# Altium schematic sheet 13.RK3588_PCIE2.0_PCIE3.0.SchDoc
size A3; SheetNumber: 13; SheetTotal: 21
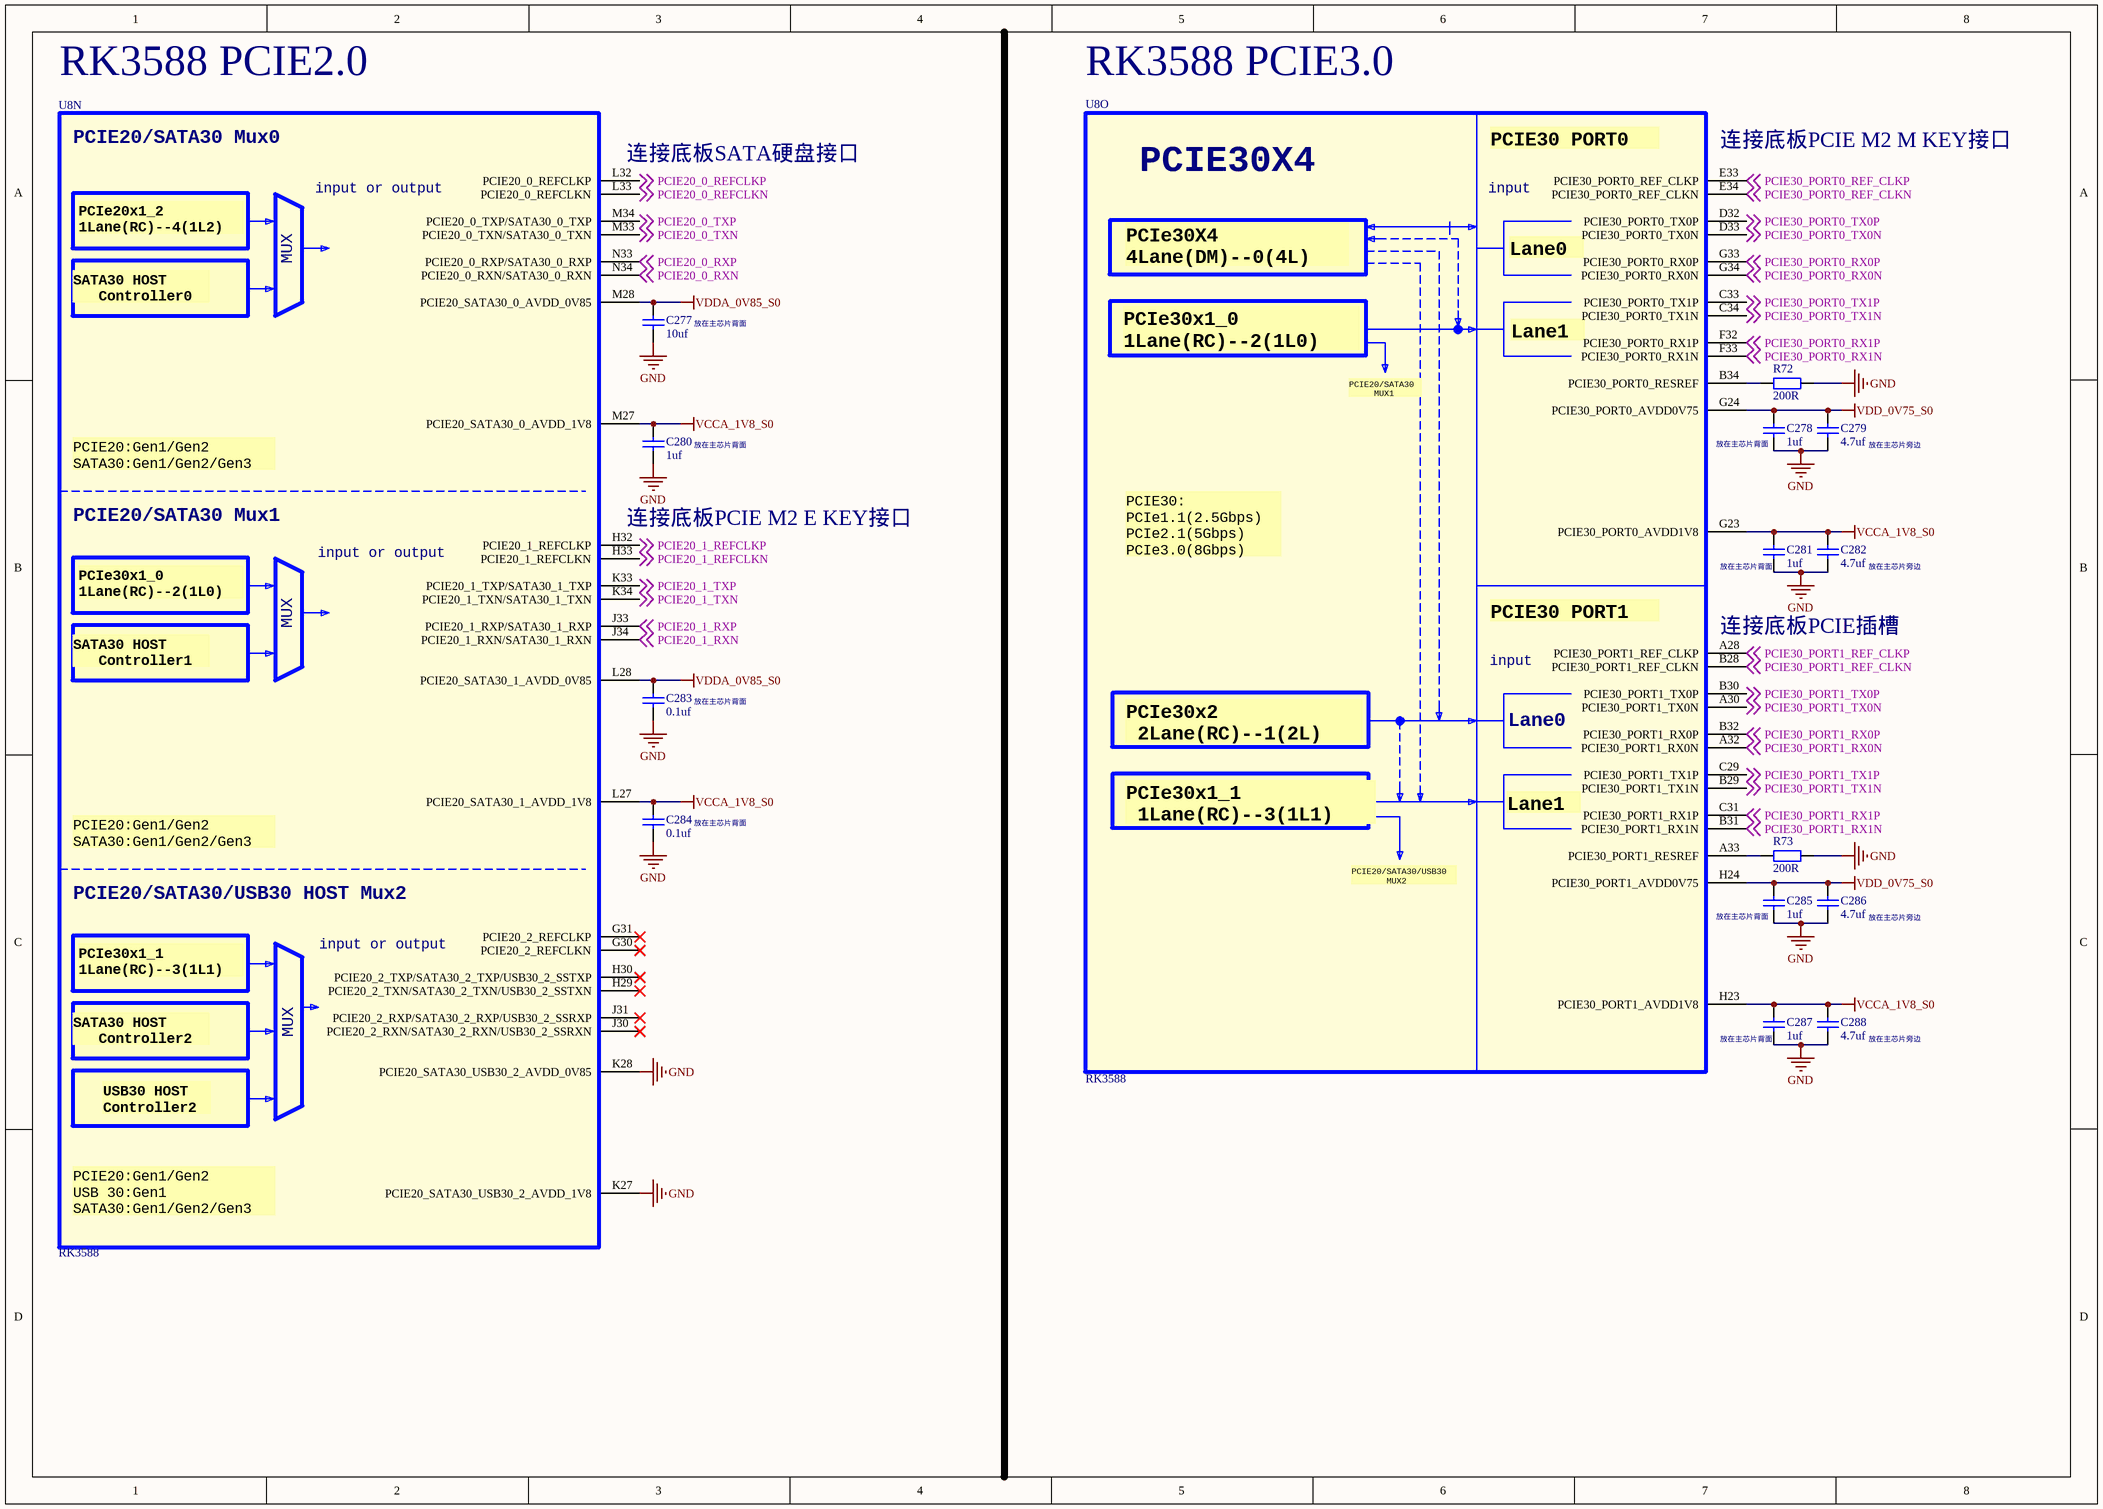
[diagram p0: 13.RK3588_PCIE2.0_PCIE3.0.SchDoc]

## Parts
C277  10uf  [C0201_L]
C278  1uf  [C0201_L]
C279  4.7uf  [C0402_L]
C280  1uf  [C0201_L]
C281  1uf  [C0201_L]
C282  4.7uf  [C0402_L]
C283  0.1uf  [C0201_L]
C284  0.1uf  [C0201_L]
C285  1uf  [C0201_L]
C286  4.7uf  [C0402_L]
C287  1uf  [C0201_L]
C288  4.7uf  [C0402_L]
R72  200R  [R0201_L]
R73  200R  [R0201_L]
U8  RK3588  [BGA1088_23R00X23R00X2R00]  (parts N,O of 26)

## Nets
GND: C277.1 C278.1 C279.1 C280.1 C281.1 C282.1 C283.1 C284.1 C285.1 C286.1 C287.1 C288.1 R72.2 R73.2 U8.K27(PCIE20_SATA30_USB30_2_AVDD_1V8) U8.K28(PCIE20_SATA30_USB30_2_AVDD_0V85)
VCCA_1V8_S0: C280.2 C281.2 C282.2 C284.2 C287.2 C288.2 U8.G23(PCIE30_PORT0_AVDD1V8) U8.H23(PCIE30_PORT1_AVDD1V8) U8.L27(PCIE20_SATA30_1_AVDD_1V8) U8.M27(PCIE20_SATA30_0_AVDD_1V8)
VDD_0V75_S0: C278.2 C279.2 C285.2 C286.2 U8.G24(PCIE30_PORT0_AVDD0V75) U8.H24(PCIE30_PORT1_AVDD0V75)
VDDA_0V85_S0: C277.2 C283.2 U8.L28(PCIE20_SATA30_1_AVDD_0V85) U8.M28(PCIE20_SATA30_0_AVDD_0V85)
PCIE20_0_REFCLKN: U8.L33(PCIE20_0_REFCLKN) ; off-sheet PCIE20_0_REFCLKN
PCIE20_0_REFCLKP: U8.L32(PCIE20_0_REFCLKP) ; off-sheet PCIE20_0_REFCLKP
PCIE20_0_RXN: U8.N34(PCIE20_0_RXN/SATA30_0_RXN) ; off-sheet PCIE20_0_RXN
PCIE20_0_RXP: U8.N33(PCIE20_0_RXP/SATA30_0_RXP) ; off-sheet PCIE20_0_RXP
PCIE20_0_TXN: U8.M33(PCIE20_0_TXN/SATA30_0_TXN) ; off-sheet PCIE20_0_TXN
PCIE20_0_TXP: U8.M34(PCIE20_0_TXP/SATA30_0_TXP) ; off-sheet PCIE20_0_TXP
PCIE20_1_REFCLKN: U8.H33(PCIE20_1_REFCLKN) ; off-sheet PCIE20_1_REFCLKN
PCIE20_1_REFCLKP: U8.H32(PCIE20_1_REFCLKP) ; off-sheet PCIE20_1_REFCLKP
PCIE20_1_RXN: U8.J34(PCIE20_1_RXN/SATA30_1_RXN) ; off-sheet PCIE20_1_RXN
PCIE20_1_RXP: U8.J33(PCIE20_1_RXP/SATA30_1_RXP) ; off-sheet PCIE20_1_RXP
PCIE20_1_TXN: U8.K34(PCIE20_1_TXN/SATA30_1_TXN) ; off-sheet PCIE20_1_TXN
PCIE20_1_TXP: U8.K33(PCIE20_1_TXP/SATA30_1_TXP) ; off-sheet PCIE20_1_TXP
PCIE30_PORT0_REF_CLKN: U8.E34(PCIE30_PORT0_REF_CLKN) ; off-sheet PCIE30_PORT0_REF_CLKN
PCIE30_PORT0_REF_CLKP: U8.E33(PCIE30_PORT0_REF_CLKP) ; off-sheet PCIE30_PORT0_REF_CLKP
PCIE30_PORT0_RX0N: U8.G34(PCIE30_PORT0_RX0N) ; off-sheet PCIE30_PORT0_RX0N
PCIE30_PORT0_RX0P: U8.G33(PCIE30_PORT0_RX0P) ; off-sheet PCIE30_PORT0_RX0P
PCIE30_PORT0_RX1N: U8.F33(PCIE30_PORT0_RX1N) ; off-sheet PCIE30_PORT0_RX1N
PCIE30_PORT0_RX1P: U8.F32(PCIE30_PORT0_RX1P) ; off-sheet PCIE30_PORT0_RX1P
PCIE30_PORT0_TX0N: U8.D33(PCIE30_PORT0_TX0N) ; off-sheet PCIE30_PORT0_TX0N
PCIE30_PORT0_TX0P: U8.D32(PCIE30_PORT0_TX0P) ; off-sheet PCIE30_PORT0_TX0P
PCIE30_PORT0_TX1N: U8.C34(PCIE30_PORT0_TX1N) ; off-sheet PCIE30_PORT0_TX1N
PCIE30_PORT0_TX1P: U8.C33(PCIE30_PORT0_TX1P) ; off-sheet PCIE30_PORT0_TX1P
PCIE30_PORT1_REF_CLKN: U8.B28(PCIE30_PORT1_REF_CLKN) ; off-sheet PCIE30_PORT1_REF_CLKN
PCIE30_PORT1_REF_CLKP: U8.A28(PCIE30_PORT1_REF_CLKP) ; off-sheet PCIE30_PORT1_REF_CLKP
PCIE30_PORT1_RX0N: U8.A32(PCIE30_PORT1_RX0N) ; off-sheet PCIE30_PORT1_RX0N
PCIE30_PORT1_RX0P: U8.B32(PCIE30_PORT1_RX0P) ; off-sheet PCIE30_PORT1_RX0P
PCIE30_PORT1_RX1N: U8.B31(PCIE30_PORT1_RX1N) ; off-sheet PCIE30_PORT1_RX1N
PCIE30_PORT1_RX1P: U8.C31(PCIE30_PORT1_RX1P) ; off-sheet PCIE30_PORT1_RX1P
PCIE30_PORT1_TX0N: U8.A30(PCIE30_PORT1_TX0N) ; off-sheet PCIE30_PORT1_TX0N
PCIE30_PORT1_TX0P: U8.B30(PCIE30_PORT1_TX0P) ; off-sheet PCIE30_PORT1_TX0P
PCIE30_PORT1_TX1N: U8.B29(PCIE30_PORT1_TX1N) ; off-sheet PCIE30_PORT1_TX1N
PCIE30_PORT1_TX1P: U8.C29(PCIE30_PORT1_TX1P) ; off-sheet PCIE30_PORT1_TX1P
NetR72_1: R72.1 U8.B34(PCIE30_PORT0_RESREF)
NetR73_1: R73.1 U8.A33(PCIE30_PORT1_RESREF)

Not connected (* = marked no-connect by the designer): U8 G30(PCIE20_2_REFCLKN)* G31(PCIE20_2_REFCLKP)* H29(PCIE20_2_TXN/SATA30_2_TXN/USB30_2_SSTXN)* H30(PCIE20_2_TXP/SATA30_2_TXP/USB30_2_SSTXP)* J30(PCIE20_2_RXN/SATA30_2_RXN/USB30_2_SSRXN)* J31(PCIE20_2_RXP/SATA30_2_RXP/USB30_2_SSRXP)*

## Notes on the sheet
- RK3588 PCIE2.0
- RK3588 PCIE3.0
- (near U8) 连接底板SATA硬盘接口
- (near U8) 连接底板PCIE M2 M KEY接口
- (near C277) 放在主芯片背面
- (near C280) 放在主芯片背面
- (near U8) 放在主芯片背面
- (near C279) 放在主芯片旁边
- (near U8) 连接底板PCIE M2 E KEY接口
- (near C282) 放在主芯片旁边
- (near U8) 连接底板PCIE插槽
- (near C283) 放在主芯片背面
- (near C284) 放在主芯片背面
- (near C286) 放在主芯片旁边
- 放在主芯片背面
- (near C288) 放在主芯片旁边
- (in symbol SOC_RK3588, part N) PCIE20/SATA30 Mux0; input or output; PCIe20x1_2 / 1Lane(RC)--4(1L2); MUX; SATA30 HOST / Controller0; PCIE20:Gen1/Gen2 / SATA30:Gen1/Gen2/Gen3; PCIE20/SATA30 Mux1; PCIe30x1_0 / 1Lane(RC)--2(1L0); SATA30 HOST / Controller1; PCIE20/SATA30/USB30 HOST Mux2; PCIe30x1_1 / 1Lane(RC)--3(1L1); SATA30 HOST / Controller2; USB30 HOST / Controller2; PCIE20:Gen1/Gen2 / USB 30:Gen1 / SATA30:Gen1/Gen2/Gen3
- (in symbol SOC_RK3588, part O) PCIE30 PORT0 /; PCIE30X4; input; Lane0 /; PCIe30X4 / 4Lane(DM)--0(4L); Lane1 /; PCIe30x1_0 / 1Lane(RC)--2(1L0); PCIE20/SATA30 / MUX1; PCIE30: / PCIe1.1(2.5Gbps) / PCIe2.1(5Gbps) / PCIe3.0(8Gbps) /; PCIE30 PORT1 /; Lane0; PCIe30x2 / 2Lane(RC)--1(2L); PCIe30x1_1 / 1Lane(RC)--3(1L1); PCIE20/SATA30/USB30 / MUX2

## Library data of the parts
C277-C288 = C: 贴片电容/MLCC电容
R72 R73 = R: 贴片电阻
U8 = SOC_RK3588: ROCKCHIP SOC